# EAGLE schematic ESP8266-07 (EAGLE 7.6.0)
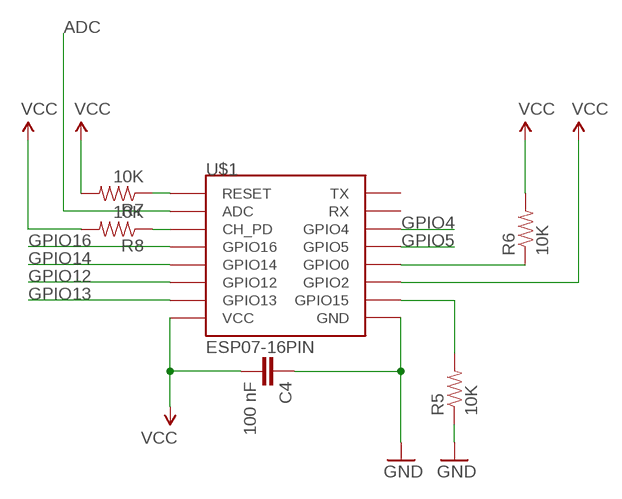
[diagram p0: schematic, sheet 1]

## Parts
C4  100 nF  CAP0805  [0805]
R5  10K  RESISTOR0805-RES  [0805]
R6  10K  RESISTOR0805-RES  [0805]
R7  10K  RESISTOR0805-RES  [0805]
R8  10K  RESISTOR0805-RES  [0805]
U$1  ESP07-16PIN  [ESP07-16PIN]

## Nets
ADC: U$1.ADC
GND: C4.1 R5.1 U$1.GND
GPIO4: U$1.GPIO4
GPIO5: U$1.GPIO5
GPIO12: U$1.GPIO12
GPIO13: U$1.GPIO13
GPIO14: U$1.GPIO14
GPIO16: U$1.GPIO16
N$1: R5.2 U$1.GPIO15
N$6: R6.1 U$1.GPIO0
N$9: R7.1 U$1.REST(RESET)
N$10: R8.1 U$1.CH_PD
VCC [SUPPLY]: C4.2 R6.2 R7.2 R8.2 U$1.GPIO2 U$1.VCC
Unconnected: U$1.RX U$1.TX

## Library data of the parts
C4 = SparkFun-Capacitors:CAP: Capacitor Standard 0603 ceramic capacitor, and 0.1" leaded capacitor.
R5-R8 = SparkFun-Resistors:RESISTOR: Resistor Basic schematic elements and footprints for 0603, 1206, and PTH resistors.
U$1 = esp8266modules:ESP07-16PIN: ESP8266 Wifi module 07 - 16 pins; DIMENSIONS: 22.0 x 16.0 mm; PINS: 16; PITCH: 0.078" / 2 mm

## Net classes
0 default: width 0.3 mm
1 GND: width 0.5 mm, clearance 0.5 mm
2 SUPPLY: width 0.5 mm, clearance 0.003 mm